# Altium schematic sheet ACtoDc.SchDoc
size A
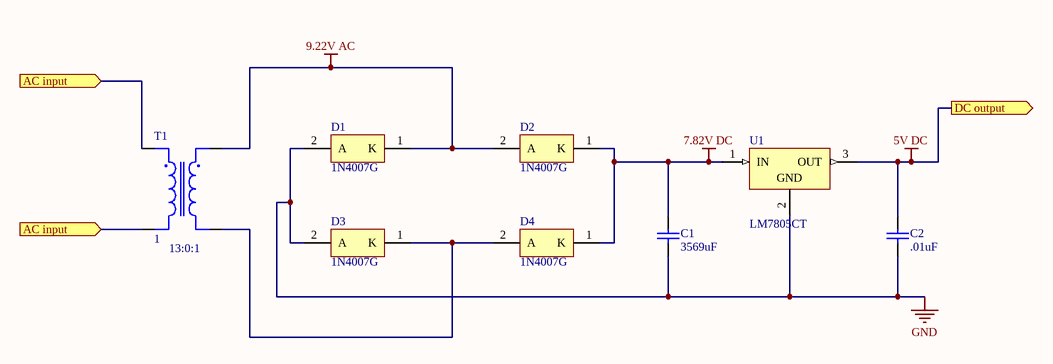
[diagram p0: ACtoDc.SchDoc]

## Parts
C1  value 3569uF  (hidden comment: Capacitor)
C2  value .01uF  (hidden comment: Capacitor)
D1  1N4007G  [ONSC-AXIAL_LEAD-2-59-10_P]
D2  1N4007G  [ONSC-AXIAL_LEAD-2-59-10_P]
D3  1N4007G  [ONSC-AXIAL_LEAD-2-59-10_P]
D4  1N4007G  [ONSC-AXIAL_LEAD-2-59-10_P]
T1  GAIN: 1  (hidden comment: Ideal Transformer)
U1  LM7805CT  [FAIR-TO-220-3]

## Ports
AC input (in), DC output (out)

## Nets
5V DC: C2.2 U1.3(OUT) ; port DC output
7.82V DC: C1.2 D2.1(K) D4.1(K) U1.1(IN)
9.22V AC: D1.1(K) D2.2(A) T1.3
GND: C1.1 C2.1 D1.2(A) D3.2(A) U1.2(GND)
AC input: T1.1 T1.2 ; port AC input
NetD3_1: D3.1(K) D4.2(A) T1.4

## Notes on the sheet
- (near T1) 13:0:1

## Library data of the parts
C1 C2 = Capacitor: SimulationGenericComponent: True
D1-D4 = CMP-0902-00143-1: Standard Recovery Rectifier, 2-Pin Axial_Lead, Pb-Free, Bulk Bag; Manufacturer: On Semiconductor; VRRM Max (V): 1000; IFSM Max (A): 30; IO(rec) Max (A): 1; ComponentLink2Description: Datasheet; ComponentLink2URL: http://www.onsemi.com/pub_link/Collateral/1N4001-D.PDF; PackageDescription: 2-Pin, Axial Lead, Diameter 2.35 mm; PartNumber: 1N4007G; ComponentLink1URL: http://www.onsemi.com/; ComponentLink3URL: http://www.onsemi.cn/pub_link/Collateral/59-10.PDF; PackageReference: AXIAL_LEAD-2-59-10; ComponentLink1Description: Manufacturer URL; Mounting Technology: Through Hole; ComponentLink3Description: Package Specification; Packing: Bulk Bag; PackageVersion: Rev. U, 02/2005; DatasheetVersion: Rev. 13; RoHS: TRUE; Type: Standard Recovery
T1 = Transformer Ideal: SimulationGenericComponent: True
U1 = CMP-2000-04938-1: Positive Voltage Regulator, 5 V, 1 A, -40 to 125 degC, 3-Pin TO-220, RoHS, Tube; Manufacturer: FairchildSemiconductor; Maximum Input Voltage: 35V; Maximum Quiescent Current: 8mA; Load Regulation: 100mV; Maximum Output Current: 2.2(Typ)A; Output Type: Fixed; Typical Dropout Voltage @ Current: 2@1AV; Rad Hard: No; Output Voltage: 5V; Accuracy: ±4%; Number of Outputs: 1; Category: LinearRegulator; Package Description: 3-Pin Through Hole Device, Body 10 x 4.5 mm, Pitch 2.54 mm; Packaging: Rail/Tube; Mounting: ThroughHole; Polarity: Positive; Manufacturer URL: https://www.fairchildsemi.com/; Line Regulation: 100mV; Datasheet Version: Aug-12; Datasheet URL: https://datasheet.ciiva.com/26904/lm7805ct-26904988.pdf; Package Reference: TO-220; Package URL: https://www.fairchildsemi.com/package-drawings/TO/TO220B03.pdf; Package: 3TO-220AB; Operating Temperature: -40to125degC; Type: Linear